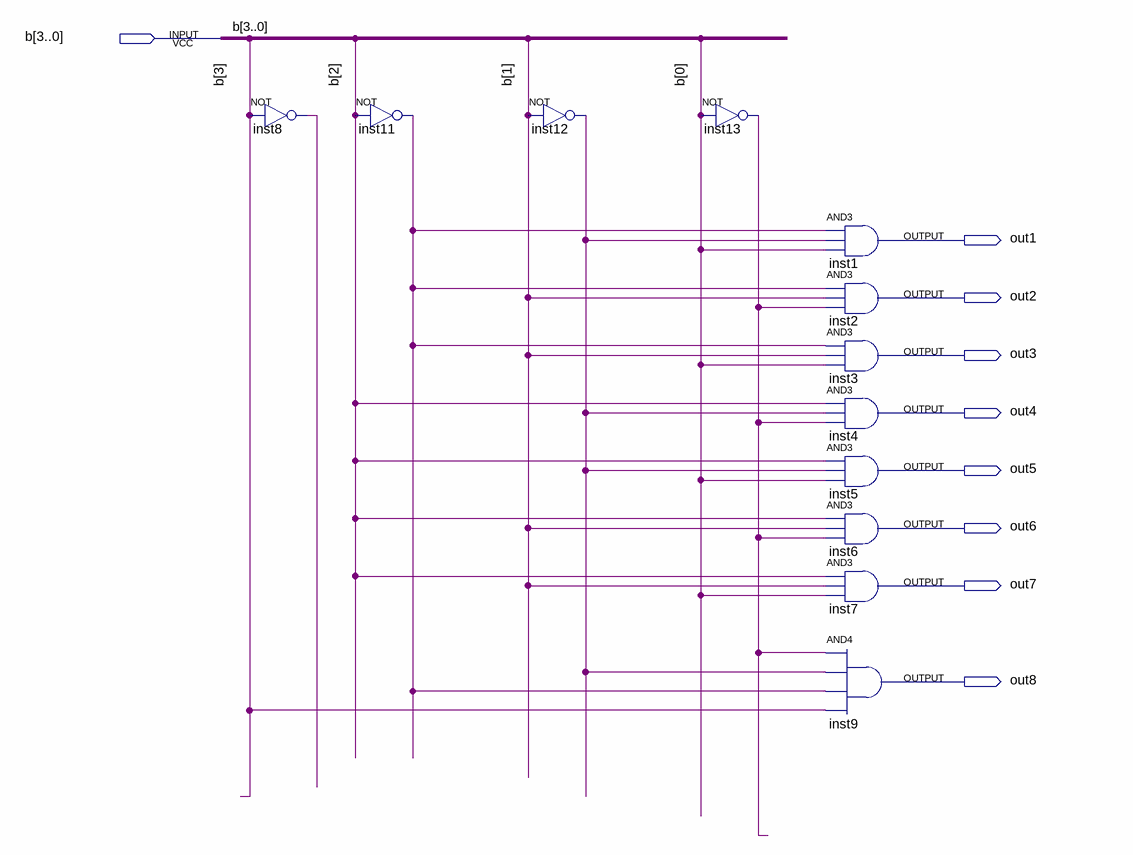
[diagram p0: schematic sheet]
// Quartus schematic b2d_3bit.bdf as structural Verilog: 12 symbols, 9 pins
module b2d_3bit (
  input  [3:0] b,
  output out1,
  output out2,
  output out3,
  output out4,
  output out5,
  output out6,
  output out7,
  output out8
);

  wire inst8_out, inst11_out, inst12_out, inst13_out;

  not inst8 (inst8_out, b[3]);
  not inst11 (inst11_out, b[2]);
  not inst12 (inst12_out, b[1]);
  not inst13 (inst13_out, b[0]);
  and inst1 (out1, inst11_out, inst12_out, b[0]);
  and inst2 (out2, inst11_out, b[1], inst13_out);
  and inst3 (out3, inst11_out, b[1], b[0]);
  and inst4 (out4, b[2], inst12_out, inst13_out);
  and inst5 (out5, b[2], inst12_out, b[0]);
  and inst6 (out6, b[2], b[1], inst13_out);
  and inst7 (out7, b[2], b[1], b[0]);
  and inst9 (out8, inst13_out, inst12_out, inst11_out, b[3]);
endmodule
